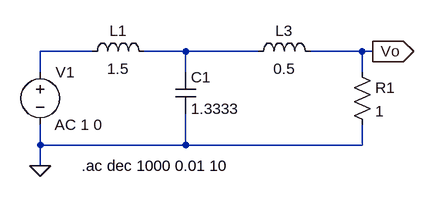
[diagram p0: schematic TS6_Albanesi_SimulacionCircuitalPunto2a.asc]
TS6_Albanesi_SimulacionCircuitalPunto2a.asc, the LTspice schematic file:
Version 4
SHEET 1 880 680
WIRE 16 80 -64 80
WIRE 160 80 96 80
WIRE 272 80 160 80
WIRE 432 80 352 80
WIRE 448 80 432 80
WIRE -64 112 -64 80
WIRE 160 112 160 80
WIRE 432 112 432 80
WIRE -64 224 -64 192
WIRE 160 224 160 176
WIRE 160 224 -64 224
WIRE 432 224 432 192
WIRE 432 224 160 224
WIRE -64 256 -64 224
FLAG -64 256 0
FLAG 448 80 Vo
IOPIN 448 80 Out
SYMBOL voltage -64 96 R0
WINDOW 123 22 97 Left 2
WINDOW 39 0 0 Left 0
SYMATTR InstName V1
SYMATTR Value ""
SYMATTR Value2 AC 1 0
SYMBOL ind 0 96 R270
WINDOW 0 32 56 VTop 2
WINDOW 3 5 56 VBottom 2
SYMATTR InstName L1
SYMATTR Value 1.5
SYMBOL ind 256 96 R270
WINDOW 0 32 56 VTop 2
WINDOW 3 5 56 VBottom 2
SYMATTR InstName L3
SYMATTR Value 0.5
SYMBOL res 416 96 R0
SYMATTR InstName R1
SYMATTR Value 1
SYMBOL cap 144 112 R0
SYMATTR InstName C1
SYMATTR Value 1.3333
TEXT 0 256 Left 2 !.ac dec 1000 0.01 10

The netlist it stands for:
* TS6_Albanesi_SimulacionCircuitalPunto2a.asc
V1 N001 0 AC 1 0
L1 N001 N002 1.5
L3 N002 Vo 0.5
R1 Vo 0 1
C1 N002 0 1.3333
.ac dec 1000 0.01 10
.backanno
.end

* Results of the author's LTspice run, read from the files saved beside the schematic
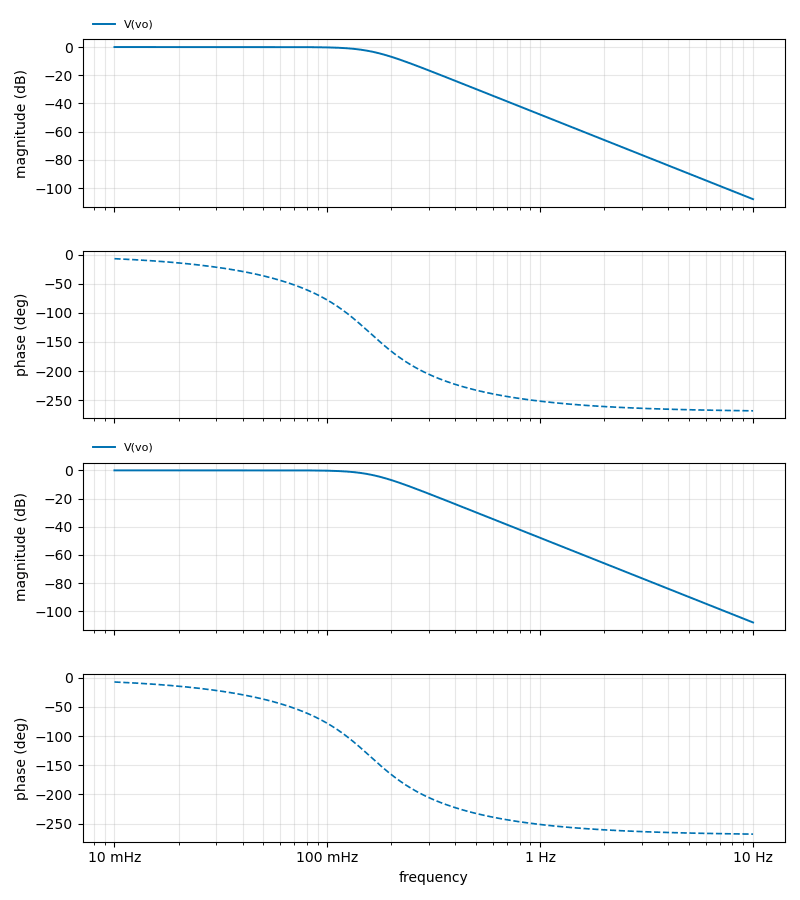
[diagram p1: AC Analysis of TS6_Albanesi_SimulacionCircuitalPunto2a.asc, plotted from the saved traces]
* AC Analysis, 1 run:
*   V(vo): -0.02 dB at 10 mHz, -107.89 dB at 10 Hz, peak -0.02 dB at 35.16 mHz, 3 dB below the peak at 159.2 mHz
*   V(vo): -0.02 dB at 10 mHz, -107.89 dB at 10 Hz, peak -0.02 dB at 35.16 mHz, 3 dB below the peak at 159.2 mHz